# EasyEDA Pro project ProProject_nRF52840无线键盘_2024-02-15.epro, board PCB4
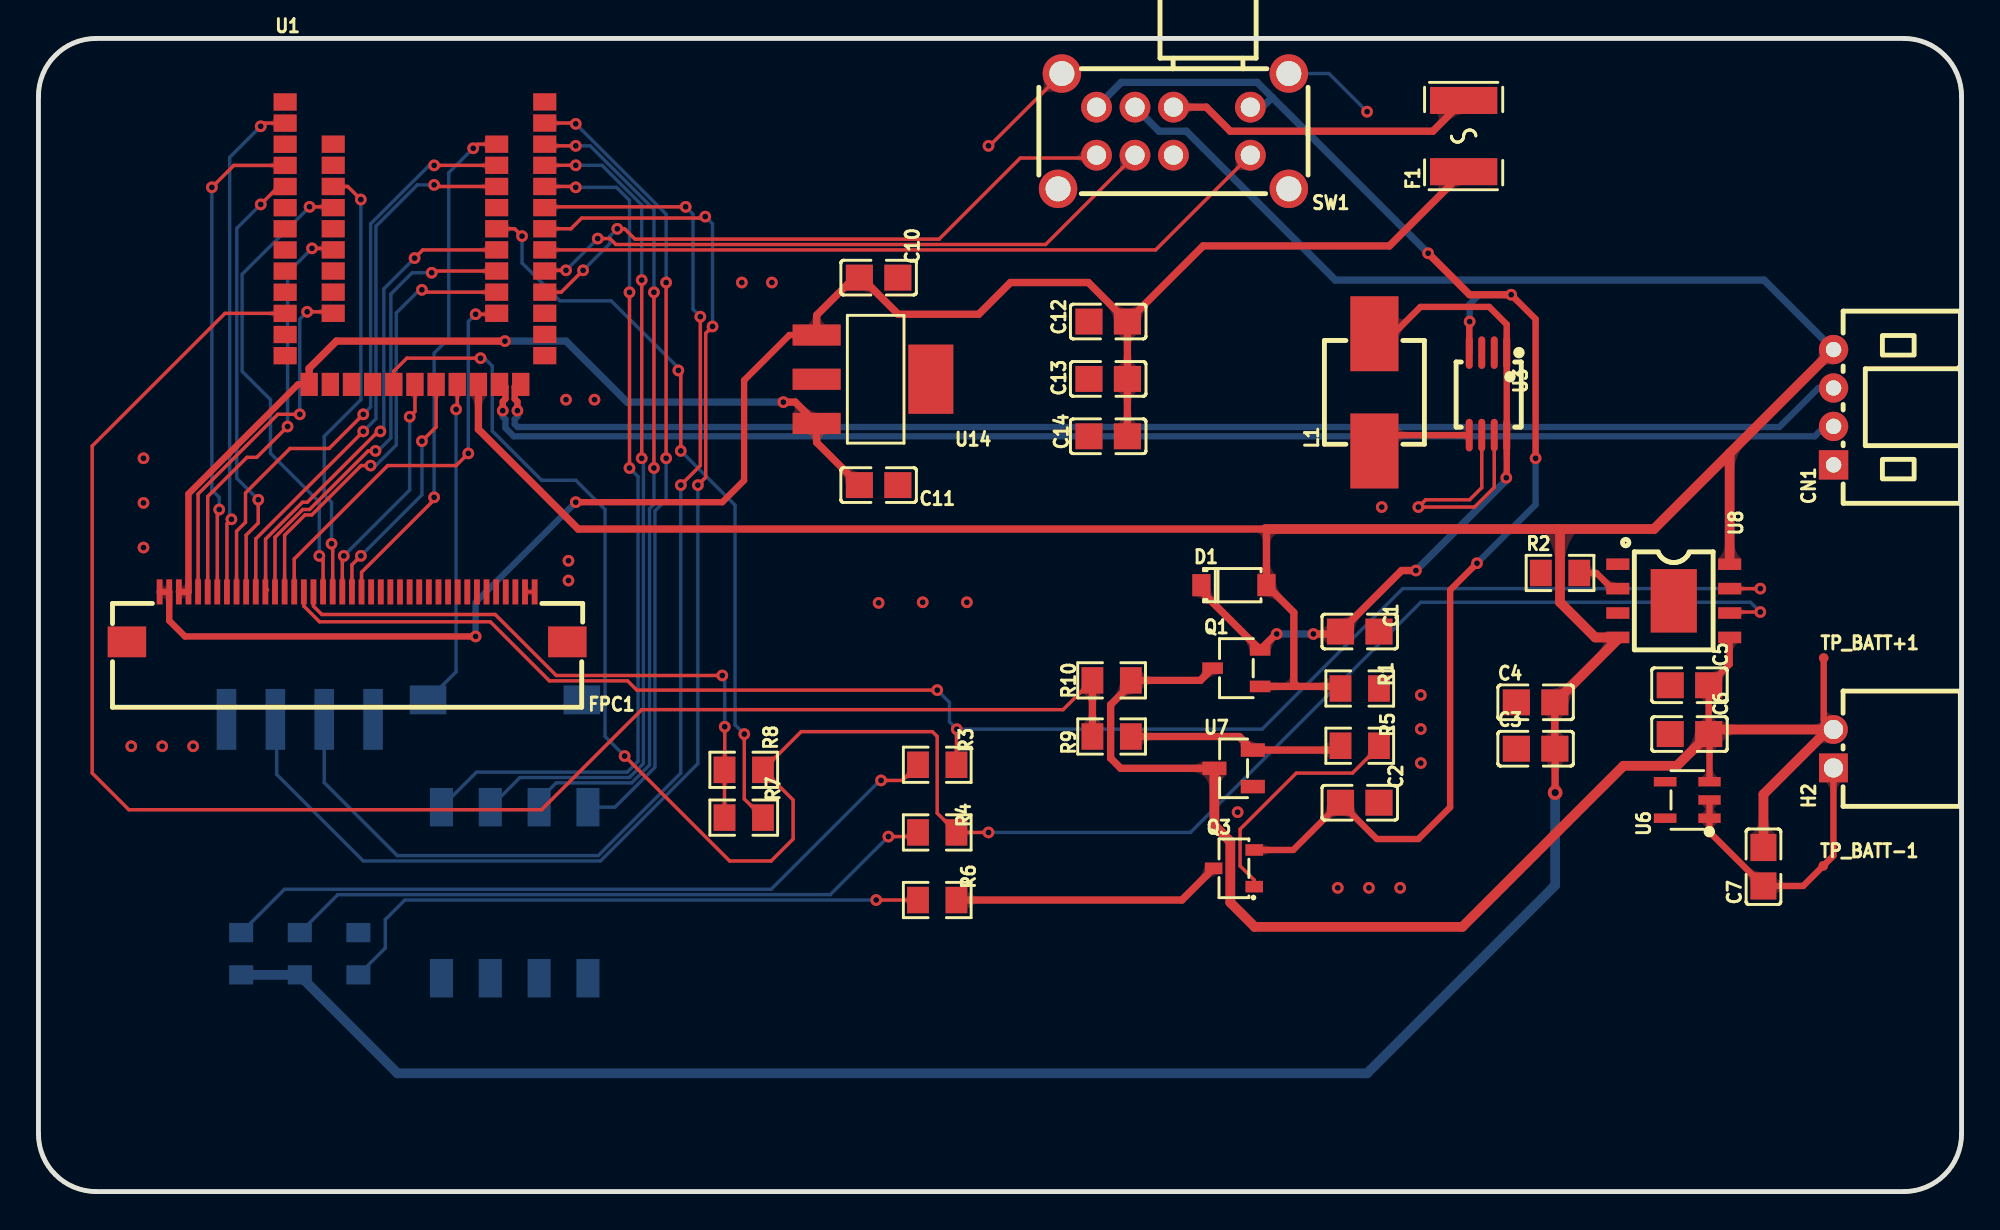
[diagram p18: board, top side]
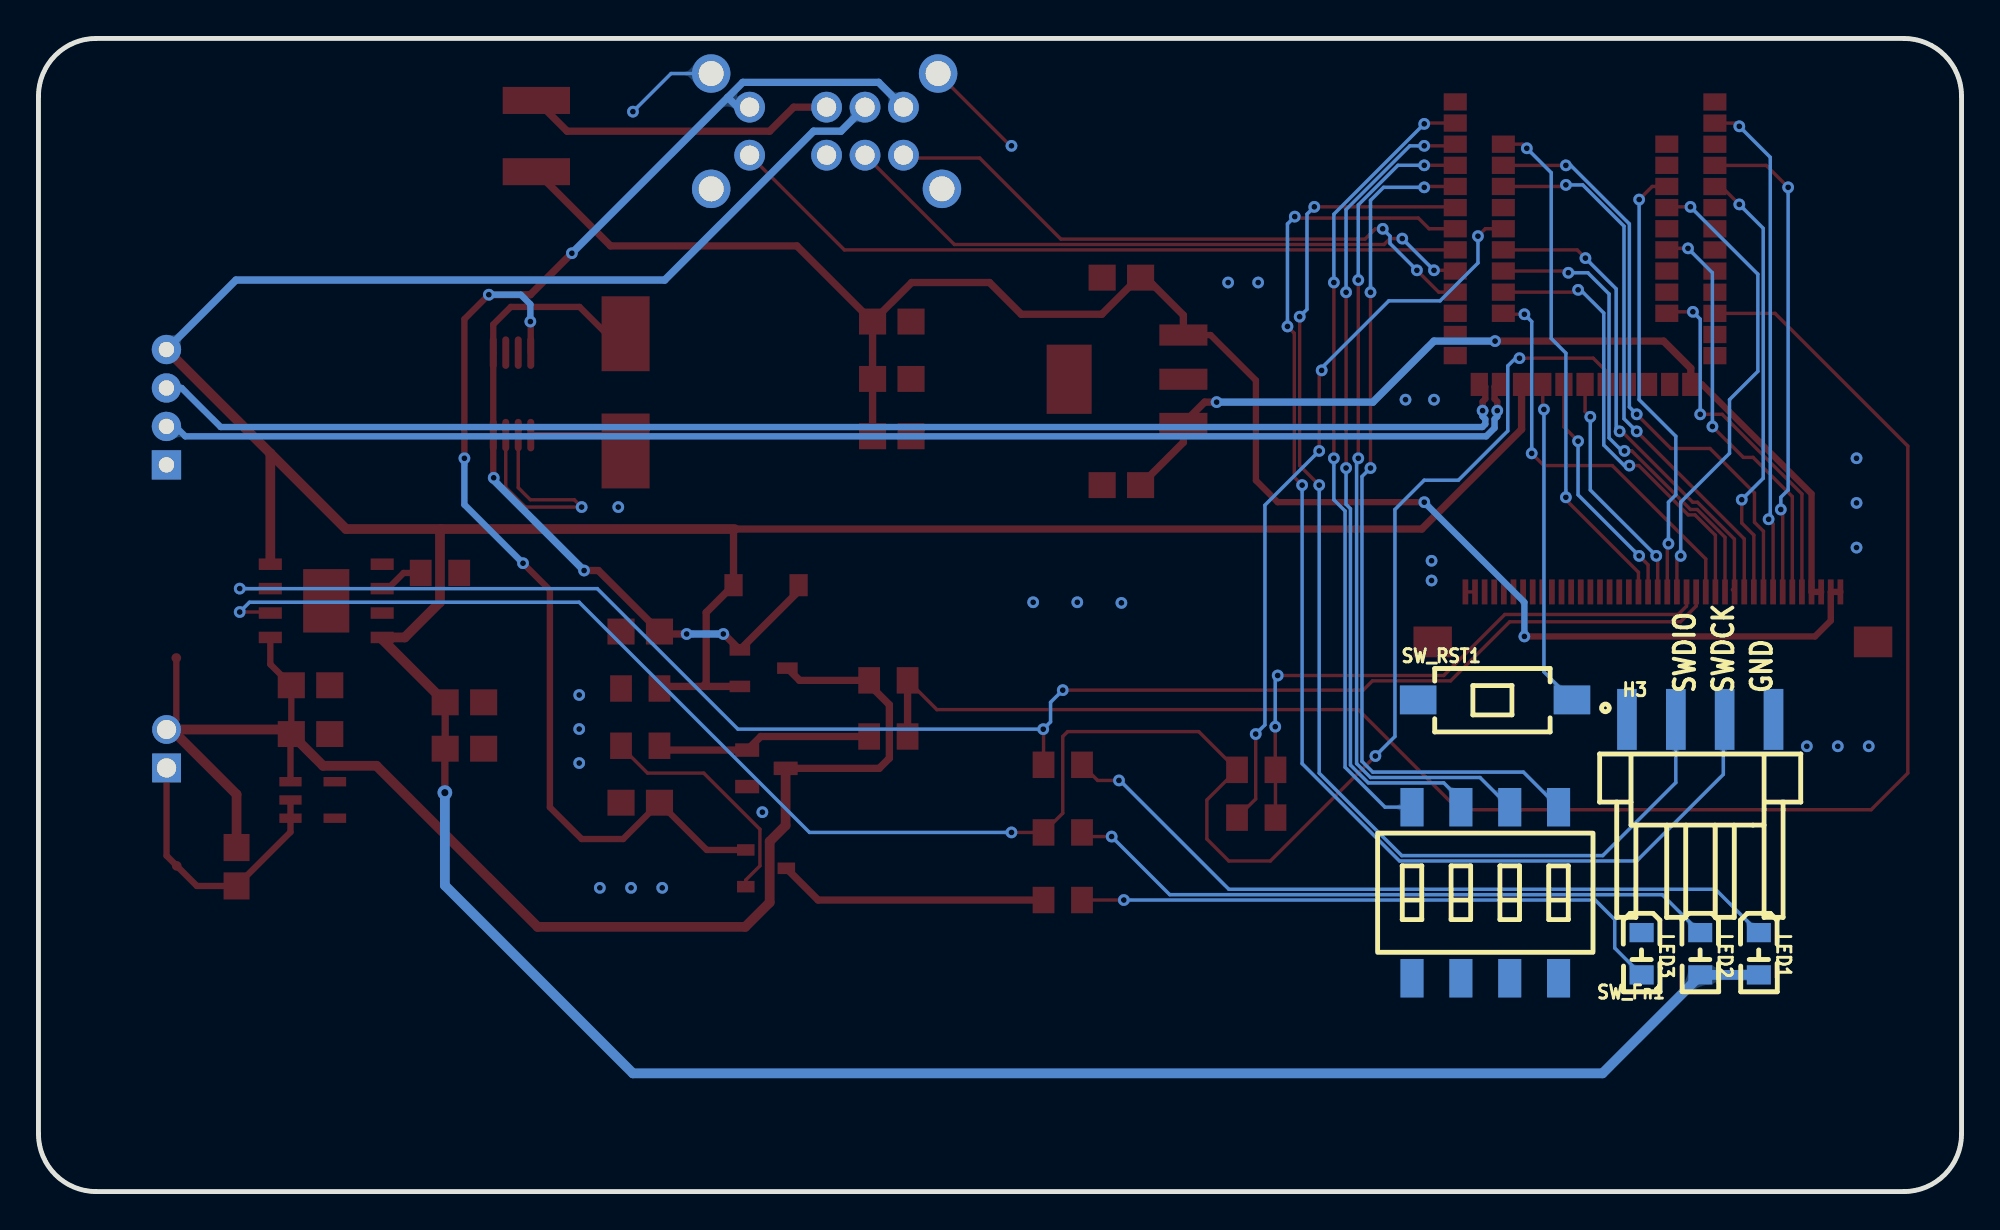
[diagram p19: board, bottom side, seen from below]

Outline 100 x 60 mm; copper layers: Top Layer, Bottom Layer. Coordinates in mm from the lower left corner of the outline.
Outline path: 0,57 0,3 arc(0.88,0.88) 3,0 97,0 arc(99.12,0.88) 100,3 100,57 arc(99.12,59.12) 97,60 3,60 arc(0.88,59.12) 0,57
Stack: Top Layer 0.035mm / Dielectric1 1.51mm FR4 er 4.5 / Bottom Layer 0.035mm

## Design rules (mm)
net D+: DP1
net D-: DP1
template: JLCPCB Capability(Two Layers Board)
spacing copperThickness1oz (default): track to track 0.102, other pairs 0.152 to 0.3
spacing copperThickness2oz: track to track 0.203, other pairs 0.152 to 0.3
track width copperThickness1oz (default): min 0.127, default 0.254, max 2.54
track width copperThickness2oz: min 0.203, default 0.254, max 2.54
differential pair differentialPair (default): width min 0.127, default 0.254, max 2.54; gap min 0.152, default 0.152
via viaSize (default): diameter min 0.5, default 0.61, max 10; hole min 0.3, default 0.305, max 6.3

## Placement (name value [footprint] x y rotation side)
C1  10uF  [C0805]  68.71 29.14 180 top
C2  10uF  [C0805]  68.71 20.23 180 top
C3  10uF  [C0805]  77.85 23.04 0 top
C4  100nF  [C0805]  77.85 25.46 0 top
C5  10uF  [C0805]  85.85 26.34 180 top
C6  100nF  [C0805]  85.85 23.81 180 top
C7  100nF  [C0805]  89.7 16.9 90 top
C10  1uF  [C0805]  43.69 47.55 180 top
C11  1uF  [C0805]  43.69 36.76 180 top
C12  10uF  [C0805]  55.63 45.27 0 top
C13  100nF  [C0805]  55.63 42.28 0 top
C14  1uF  [C0805]  55.63 39.3 0 top
CN1  HDGC2001WR-4P  [CONN-TH_4P-P2.00_HDGC_HDGC2001WR-4P]  93.34 40.81 90 top
D1  B5817W  [SOD-123_L2.8-W1.8-LS3.7-RD]  62.16 31.55 0 top
F1  BSMD1812-300-16V  [F1812]  74.11 54.92 90 top
FPC1  AFC01-S40FCA-00  [FPC-SMD_P0.50-40P_FGS-XJ-H2.0]  16.05 29.9 180 top
H2  HDGC2001WR-2P  [CONN-TH_2P-P2.00_HDGC2001WR-2P]  93.34 23.04 90 top
H3  1125-1104G0Z087CR01  [CONN-SMD_1125-1104G0Z087CR01]  13.59 24.57 180 bottom
L1  4.7uH  [ind-smd_l5.4-w5.2_fxl0530]  69.47 41.58 90 top
LED1  NCD0805R1  [LED0805-RD_RED]  10.54 12.37 270 bottom
LED2  NCD0805R1  [LED0805-RD_RED]  13.59 12.37 270 bottom
LED3  NCD0805R1  [LED0805-RD_RED]  16.64 12.37 270 bottom
Q1  CJ3401  [SOT-23-3_L2.9-W1.6-P1.90-LS2.8-BR]  62.29 27.23 0 top
Q3  AO3401  [SOT-23-3_L2.9-W1.4-P1.90-LS2.6-BR]  62.16 16.82 0 top
R1  10kΩ  [R0805]  68.71 26.17 180 top
R2  1.5kΩ  [R0805]  79.12 32.19 0 top
R3  2kΩ  [R0805]  46.74 22.21 180 top
R4  2kΩ  [R0805]  46.74 18.69 180 top
R5  10kΩ  [R0805]  68.71 23.2 0 top
R6  5.1kΩ  [R0805]  46.74 15.17 0 top
R7  0Ω  [R0805]  36.67 19.46 180 top
R8  0Ω  [R0805]  36.67 21.94 180 top
R9  0Ω  [R0805]  55.8 23.68 0 top
R10  0Ω  [R0805]  55.8 26.6 0 top
SW1  SK-23D29-G080  [SW-TH_G-SWITCH_SK-23D29-G080]  59.02 55.17 180 top
SW_Fn1  DSIC04LS-P  [SW-SMD_8P-L11.1-W6.2-P2.54-LS9.8]  24.77 15.55 0 bottom
SW_RST1  TS-1101-C-W  [SW-SMD_L6.0-W3.3-LS8.0]  24.26 25.58 180 bottom
TP_BATT+1  -  [Test-Point-0.5mm]  92.83 27.76 0 top
TP_BATT-1  -  [Test-Point-0.5mm]  92.81 16.95 0 top
U1  -  [微雪 nrf52840]  12.83 56.7 0 top
U3  MCP1642B-50I/MS  [MSOP-8_L3.0-W3.0-P0.65-LS5.0-BL]  75.38 41.51 180 top
U6  IP3012A  [SOT-23-5_L3.0-W1.7-P0.95-LS2.8-BL]  85.74 20.38 90 top
U7  TPS3839G33DBZR  [SOT-23-3_L2.9-W1.3-P1.90-LS2.4-BR]  62.15 22.02 0 top
U8  TP4056  [ESOP-8_L4.9-W3.9-P1.27-LS6.0-BL-EP]  85.03 30.74 270 top
U14  MCP1825S-3002E/DB  [SOT-223-3_L6.4-W3.5-P2.30-LS7.0-BR]  43.43 42.27 180 top

## Footprints (pads in the part's own frame, mm; a bottom-side part is the same pattern mirrored in y, then rotated)
C0805
  rect 1.41x1.35 smd: 1(-1,0) 2(1,0)
CONN-SMD_1125-1104G0Z087CR01
  rect 1.02x3.17 smd: 1(-3.81,0) 2(-1.27,0) 3(1.27,0) 4(3.81,0)
CONN-TH_2P-P2.00_HDGC2001WR-2P
  rect 1.5x1.5 hole 1: 1(-1,0)
  round 1.5 hole 1: 2(1,0)
CONN-TH_4P-P2.00_HDGC_HDGC2001WR-4P
  rect 1.524x1.524 hole 0.8: 1(-3,0)
  round 1.524 hole 0.8: 2(-1,0) 3(1,0) 4(3,0)
ESOP-8_L4.9-W3.9-P1.27-LS6.0-BL-EP
  rect 0.6x1.2 smd: 1(-1.905,-2.909) 2(-0.635,-2.909) 3(0.635,-2.909) 4(1.905,-2.909) 5(1.905,2.909) 6(0.635,2.909) 7(-0.635,2.909) 8(-1.905,2.909)
  rect 3.3x2.4 smd: 9(0,0)
F1812
  rect 1.407x3.499 smd: 1(-1.853,0) 2(1.853,0)
FPC-SMD_P0.50-40P_FGS-XJ-H2.0
  rect 0.3x1.3 smd: 1(-9.75,-1.3) 2(-9.25,-1.3) 3(-8.75,-1.3) 4(-8.25,-1.3) 5(-7.75,-1.3) 6(-7.25,-1.3) 7(-6.75,-1.3) 8(-6.25,-1.3) 9(-5.75,-1.3) 10(-5.25,-1.3) 11(-4.75,-1.3) 12(-4.25,-1.3) 13(-3.75,-1.3) 14(-3.25,-1.3) 15(-2.75,-1.3) 16(-2.25,-1.3) 17(-1.75,-1.3) 18(-1.25,-1.3) 19(-0.75,-1.3) 20(-0.25,-1.3) 21(0.25,-1.3) 22(0.75,-1.3) 23(1.25,-1.3) 24(1.75,-1.3) 25(2.25,-1.3) 26(2.75,-1.3) 27(3.25,-1.3) 28(3.75,-1.3) 29(4.25,-1.3) 30(4.75,-1.3) 31(5.25,-1.3) 32(5.75,-1.3) 33(6.25,-1.3) 34(6.75,-1.3) 35(7.25,-1.3) 36(7.75,-1.3) 37(8.25,-1.3) 38(8.75,-1.3) 39(9.25,-1.3) 40(9.75,-1.3)
  rect 2x1.6 smd: 41(11.45,1.3) 42(-11.45,1.3)
ind-smd_l5.4-w5.2_fxl0530
  rect 3.9x2.5 smd: 1(-3.05,0) 2(3.05,0)
LED0805-RD_RED
  rect 1x1.25 smd: 1(-1.1,0) 2(1.1,0)
MSOP-8_L3.0-W3.0-P0.65-LS5.0-BL
  oval 0.364x1.692 smd: 1(-0.975,-2.146) 2(-0.325,-2.146) 3(0.325,-2.146) 4(0.975,-2.146) 5(0.975,2.146) 6(0.325,2.146) 7(-0.325,2.146) 8(-0.975,2.146)
R0805
  rect 1.133x1.377 smd: 1(-1,0) 2(1,0)
SOD-123_L2.8-W1.8-LS3.7-RD
  rect 0.95x1.15 smd: 1(-1.692,0) 2(1.692,0)
SOT-23-3_L2.9-W1.3-P1.90-LS2.4-BR
  rect 1.25x0.7 smd: 1(1,-0.95) 2(1,0.95) 3(-1,0)
SOT-23-3_L2.9-W1.4-P1.90-LS2.6-BR
  rect 0.91x0.6 smd: 1(1.055,-0.955) 2(1.055,0.955) 3(-1.055,0)
SOT-23-3_L2.9-W1.6-P1.90-LS2.8-BR
  rect 1.07x0.6 smd: 1(1.235,-0.95) 2(1.235,0.95) 3(-1.235,0)
SOT-23-5_L3.0-W1.7-P0.95-LS2.8-BL
  rect 0.49x1.157 smd: 1(-0.95,-1.153) 2(0,-1.153) 3(0.95,-1.153)
  rect 0.49x1.175 smd: 4(0.95,1.153) 5(-0.95,1.153)
SOT-223-3_L6.4-W3.5-P2.30-LS7.0-BR
  rect 2.5x1.1 smd: 1(2.97,-2.3) 2(2.97,0) 3(2.97,2.3)
  rect 2.34x3.6 smd: 4(-2.97,0)
SW-SMD_8P-L11.1-W6.2-P2.54-LS9.8
  rect 1.2x2 smd: 1(-3.81,-4.45) 2(-1.27,-4.45) 3(1.27,-4.45) 4(3.81,-4.45) 5(3.81,4.45) 6(1.27,4.45) 7(-1.27,4.45) 8(-3.81,4.45)
SW-SMD_L6.0-W3.3-LS8.0
  rect 1.9x1.5 smd: 1(-4,0) 2(4,0)
SW-TH_G-SWITCH_SK-23D29-G080
  round 1.6 hole 1: 1(-4,1.25) 2(0,1.25) 3(2,1.25) 4(4,1.25) 5(4,-1.25) 6(2,-1.25) 7(0,-1.25) 8(-4,-1.25)
  round 2 hole 1.3: 9(-6,3) 10(6,3) 11(-6,-3) 12(5.8,-3)
Test-Point-0.5mm
  round 0.5 smd: 1(0,0)
微雪 nrf52840
  rect 1.2x0.9 smd: 1(13.5,0) 2(13.5,-1.1) 3(13.5,-2.2) 4(13.5,-3.3) 5(13.5,-4.4) 6(13.5,-5.5) 7(13.5,-6.6) 8(13.5,-7.7) 9(13.5,-8.8) 10(13.5,-9.9) 11(13.5,-11) 12(13.5,-12.1) 13(13.5,-13.2) 25(0,-13.204) 26(0,-12.104) 27(0,-11.004) 28(0,-9.904) 29(0,-8.804) 30(0,-7.704) 31(0,-6.604) 32(0,-5.504) 33(0,-4.404) 34(0,-3.304) 35(0,-2.204) 36(0,-1.104) 37(0,-0.004) 38(11,-2.2) 39(11,-3.3) 40(11,-4.4) 41(11,-5.5) 42(11,-6.6) 43(11,-7.7) 44(11,-8.8) 45(11,-9.9) 46(11,-11) 47(2.5,-11) 48(2.5,-9.9) 49(2.5,-8.8) 50(2.5,-7.7) 51(2.5,-6.6) 52(2.5,-5.5) 53(2.5,-4.4) 54(2.5,-3.3) 55(2.5,-2.2)
  rect 0.9x1.2 smd: 14(12.25,-14.7) 15(11.15,-14.7) 16(10.05,-14.7) 17(8.95,-14.7) 18(7.85,-14.7) 19(6.75,-14.7) 20(5.65,-14.7) 21(4.55,-14.7) 22(3.45,-14.7) 23(2.35,-14.7) 24(1.25,-14.7)

## Nets
As in the schematic.

Pads without a net: FPC1 3 4 5 6 7 8 9 10 11 12 13 14 15 16 17 18; H3 1; U1 11 12 21 22 23 25 26 28 29 30 31 32 35 41 48 49 51 54 55; U3 2 3; U6 5

## Via types
v1: diameter 0.61, hole 0.305, Top Layer to Bottom Layer, 112 vias
v2: diameter 0.762, hole 0.381, Top Layer to Bottom Layer, 1 via

## Routing (per net, layer and track width the routed paths; a pad name or vN(x,y) marks a point on that pad's centre or on a via; arc(x,y) is an arc through that point)
GND: length 24.3
  Top Layer w0.178: SW1.12 49.46,54.41 v1(49.4,54.41) ; FPC1.2 FPC1.1 ; U3.6 75.05,36.63 74.42,36 72.14,36 v1(71.75,35.62) 74.68,35.62 75.7,36.64 U3.7
  Bottom Layer w0.178: SW1.11 67.1,58.17 v1(69.09,56.19)
  vias: v1(4.83,23.17) v1(5.46,38.16) v1(5.46,35.83) v1(5.46,33.51) v1(6.44,23.17) v1(8.04,23.17) v1(27.43,41.2) v1(27.56,32.82) v1(27.56,31.79) v1(28.91,41.2) v1(36.58,47.3) v1(38.14,47.3) v1(43.69,30.63) v1(45.98,30.66) v1(48.28,30.66) v1(62.36,19.74) v1(67.56,15.8) v1(69.19,15.8) v1(69.85,35.62) v1(70.81,15.8) v1(71.88,25.84) v1(71.88,24.07) v1(71.88,22.3)
VBUS: length 235.6
  Top Layer w0.381: 65.45,26.28 67.69,26.28 67.71,26.3 ; 65.45,26.28 Q1.1 ; 65.45,26.28 65.28,26.46 65.28,30.13 D1.2 63.86,34.42 63.81,34.47 28.07,34.47 22.88,39.66 U1.16 ; v2(78.87,20.76) 78.87,23.03 C3.2 C4.2
  Top Layer w0.508: 63.81,34.47 79.07,34.47 ; 79.07,34.47 79.12,34.42 79.12,30.66 80.95,28.83 U8.4 82.13,28.73 C4.2 ; 79.07,34.47 84.01,34.47 87.94,38.41 ; 87.94,38.41 CN1.4 ; 87.94,38.41 U8.8
  Bottom Layer w0.381: CN1.4 89.73,47.43 67.44,47.43 59.69,55.17 58.27,55.17 SW1.6
  Bottom Layer w0.508: LED1.2 13.55,11.27 18.67,6.15 69.09,6.15 78.87,15.93 v2(78.87,20.76)
VCC3V3: length 48
  Top Layer w0.33: U1.24 13.49,42 7.8,36.3 FPC1.37 FPC1.38
  Top Layer w0.381: C11.2 40.46,38.98 U14.3 39.35,41.08 v1(38.74,41.08) ; U1.24 14.08,42.83 15.49,44.25 v1(24.26,44.25)
  Bottom Layer w0.381: v1(24.26,44.25) 27.43,44.25 30.61,41.08 v1(38.74,41.08)
VCC4V7: length 37.5
  Top Layer w0.33: v1(76.33,37.14) 76.35,37.16 U3.8 U3.1 76.35,45.12 75.44,46.03 71.86,46.03 69.47,43.64
  Top Layer w0.381: v1(66.29,29.01) 67.58,29.01 C1.2 70.88,32.31 v1(71.63,32.31) ; D1.1 60.47,31.24 Q1.2 64.36,29.01 v1(64.39,29.01)
  Bottom Layer w0.381: v1(64.39,29.01) v1(66.29,29.01) ; v1(71.63,32.31) 76.33,37.01 v1(76.33,37.14)
BATT+: length 77.5
  Top Layer w0.33: U6.3 86.9,23.76 C6.1 C5.1 87.94,27.44 U8.5 ; TP_BATT+1.1 92.83,24.55 H2.2
  Top Layer w0.381: Q1.3 60.42,26.6 R10.2 56.8,26.38 55.75,25.33 55.75,22.55 56.28,22.02 U7.3
  Top Layer w0.508: H2.2 93.07,24.04 ; 93.07,24.04 87.09,24.04 C6.1 85.2,22.15 82.42,22.15 74.04,13.77 63.25,13.77 61.98,15.04 61.98,18.22 61.15,19.05 U7.3 ; 93.07,24.04 89.7,20.67 C7.2
BATT-: length 14.5
  Top Layer w0.33: U6.2 U6.1 86.9,18.71 C7.1 91.77,15.9 TP_BATT-1.1 93.34,17.47 H2.1
BATT_LOW: length 11.3
  Top Layer w0.381: R5.1 67.48,22.97 U7.2 62.44,23.68 R9.2
BATT_SENS: length 88.4
  Top Layer w0.178: R10.1 53.28,25.08 31.37,25.08 26.16,19.87 4.7,19.87 2.79,21.77 2.79,38.79 9.7,45.69 U1.27
  Top Layer w0.381: R9.1 R10.1
BATTERY_LED: length 21.6
  Top Layer w0.178: v1(22.35,38.41) 21.72,37.78 18.16,37.78 13.3,32.91 FPC1.26 ; U1.46 23.78,45.65 v1(22.73,45.65)
  Bottom Layer w0.178: v1(22.73,45.65) 22.35,45.27 v1(22.35,38.41)
CAP_LOCK: length 23.3
  Top Layer w0.178: v1(19.94,46.92) 20.06,46.8 U1.45 ; FPC1.27 12.8,34.15 13.86,35.21 14.21,35.21 16.78,37.78 v1(17.27,37.78)
  Bottom Layer w0.178: v1(17.27,37.78) 17.54,37.78 18.61,38.84 18.61,45.71 19.81,46.92 v1(19.94,46.92)
CE#: length 25.5
  Top Layer w0.178: U1.34 10.16,53.39 v1(9.02,52.25) ; v1(9.4,35.49) 9.3,35.39 FPC1.34
  Bottom Layer w0.178: v1(9.4,35.49) 9.4,36.12 9.02,36.51 v1(9.02,52.25)
CHARGE_LED: length 86.2
  Top Layer w0.178: FPC1.25 13.8,30.46 14.61,29.65 23.5,29.65 26.57,26.57 30.63,26.57 31.12,26.09 v1(46.74,26.09) ; U8.7 v1(89.53,31.37) ; R3.1 47.74,24.04 v1(47.75,24.06)
  Bottom Layer w0.178: v1(46.74,26.09) 47.37,25.46 47.37,24.44 v1(47.75,24.06) 63.63,24.06 70.94,31.37 v1(89.53,31.37)
CP: length 21.6
  Top Layer w0.178: FPC1.35 8.8,36.16 10.84,38.2 11.35,38.2 v1(12.95,39.81) ; U1.50 15.25,49.08 v1(14.22,49.08)
  Bottom Layer w0.178: v1(12.95,39.81) 12.95,47.81 v1(14.22,49.08)
D+: length 71.9
  Top Layer w0.33: v1(24.9,40.63) 24.9,41.1 24.77,41.24 24.77,41.88 24.88,42 U1.14
  Bottom Layer w0.33: v1(24.9,40.63) 24.9,40.33 24.77,40.19 24.77,39.93 24.92,39.78 90.53,39.78 92.56,41.81 CN1.3
D-: length 72.1
  Top Layer w0.33: v1(24.14,40.63) 24.14,41.1 24.28,41.24 24.28,41.88 24.17,42 U1.15
  Bottom Layer w0.33: CN1.2 92.88,39.81 92.36,39.3 24.72,39.3 24.28,39.73 24.28,40.19 24.14,40.33 v1(24.14,40.63)
DIP1: length 45.3
  Top Layer w0.178: v1(27.94,52.25) 27.89,52.3 U1.5 ; v1(30.73,46.79) v1(30.73,37.65)
  Bottom Layer w0.178: SW_Fn1.1 22.78,21.82 30.62,21.82 31.18,22.39 31.18,37.2 v1(30.73,37.65) ; v1(27.94,52.25) 30.06,52.25 30.73,51.58 v1(30.73,46.79)
DIP2: length 43.9
  Top Layer w0.178: v1(31.37,47.43) v1(31.37,38.16) ; U1.4 v1(27.94,53.4)
  Bottom Layer w0.178: v1(31.37,38.16) 31.46,38.07 31.46,22.27 30.73,21.54 25.04,21.54 SW_Fn1.2 ; v1(31.37,47.43) 31.37,51.34 29.31,53.4 v1(27.94,53.4)
DIP3: length 43
  Top Layer w0.178: v1(27.94,54.41) 26.41,54.41 U1.3 ; v1(32,46.79) v1(32,37.65)
  Bottom Layer w0.178: SW_Fn1.3 26.03,20.38 26.92,21.27 30.85,21.27 31.78,22.19 31.78,35.53 32,35.76 v1(32,37.65) ; v1(27.94,54.41) 28.69,54.41 32,51.1 v1(32,46.79)
DIP4: length 41.6
  Top Layer w0.178: v1(32.64,47.3) v1(32.64,38.16) ; v1(27.94,55.56) 27.9,55.6 U1.2
  Bottom Layer w0.178: v1(32.64,47.3) 32.64,50.86 v1(27.94,55.56) ; v1(32.64,38.16) 32.64,36 32.06,35.41 32.06,22.08 29.98,20 SW_Fn1.4
KNOB_A: length 24.5
  Top Layer w0.178: v1(14.1,51.24) 15.29,51.24 U1.52 ; FPC1.23 14.8,32.88 v1(14.61,33.08)
  Bottom Layer w0.178: v1(14.61,33.08) 14.61,35.87 12.06,38.41 12.06,41.2 10.59,42.68 10.59,47.73 v1(14.1,51.24)
KNOB_B: length 23.1
  Top Layer w0.178: U1.53 16.08,52.3 v1(16.76,51.62) ; FPC1.22 15.3,33.65 v1(15.24,33.71)
  Bottom Layer w0.178: v1(16.76,51.62) 16.76,41.2 14.86,39.3 14.86,36.25 15.24,35.87 v1(15.24,33.71)
LED_BLUE: length 30.9
  Top Layer w0.178: R7.2 R8.2 35.69,21.96 v1(35.69,24.19) ; FPC1.24 14.3,30.46 14.73,30.03 23.75,30.03 26.92,26.85 v1(35.56,26.85)
  Bottom Layer w0.178: v1(35.56,26.85) 35.69,26.73 v1(35.69,24.19)
LED_CONTROL: length 28.8
  Top Layer w0.178: v1(20.57,52.38) 20.66,52.3 U1.40 ; v1(16.89,39.55) 11.3,33.96 FPC1.30
  Bottom Layer w0.178: v1(20.57,52.38) 19.7,52.38 17.55,50.23 17.55,40.21 v1(16.89,39.55)
LED_CUS: length 38.5
  Top Layer w0.178: v1(33.27,42.73) 33.4,42.6 v1(33.4,38.54) ; v1(36.7,23.81) 36.7,20.43 R7.1 ; v1(25.15,49.71) 24.76,50.1 U1.42
  Bottom Layer w0.178: v1(25.15,49.71) 25.15,48.32 27.11,46.35 29.78,46.35 33.27,42.86 v1(33.27,42.73) ; v1(36.7,23.81) 36.22,24.28 36.22,35.71 v1(33.4,38.54)
LEFT_CON: length 12.6
  Top Layer w0.178: v1(19.94,39.05) 20.68,39.78 U1.18 ; FPC1.20 16.3,32.61 v1(16.76,33.08)
  Bottom Layer w0.178: v1(16.76,33.08) 19.94,36.25 v1(19.94,39.05)
MODE_2.4: length 32.3
  Top Layer w0.178: v1(30.1,50.09) 30.48,50.09 31.02,49.56 46.83,49.56 51.05,53.78 54.87,53.78 SW1.4 ; v1(28.32,47.94) 27.18,46.8 U1.10
  Bottom Layer w0.178: v1(28.32,47.94) 29.72,49.33 29.72,49.71 v1(30.1,50.09)
MODE_BLE: length 38.7
  Top Layer w0.178: U1.8 58.09,49 SW1.1
MODE_WIRE: length 33.4
  Top Layer w0.178: SW1.3 52.37,49.28 30.03,49.28 29.72,49.59 v1(29.08,49.59) ; v1(27.43,47.94) 26.36,47.94 U1.9
  Bottom Layer w0.178: v1(29.08,49.59) v1(27.43,47.94)
MOS_CONTROL: length 31
  Top Layer w0.178: U1.39 23.83,53.4 v1(20.57,53.4) ; FPC1.32 10.3,34.36 10.77,34.83 10.77,36.35 13.08,38.66 15.11,38.66 v1(16.89,40.44)
  Bottom Layer w0.178: v1(20.57,53.4) 20.32,53.4 17.27,50.35 17.27,40.82 v1(16.89,40.44)
NUM_LOCK: length 24.5
  Top Layer w0.178: v1(20.45,47.81) 20.54,47.9 U1.44 ; v1(17.53,38.54) 17.14,38.54 14.1,35.49 13.74,35.49 12.3,34.04 FPC1.28
  Bottom Layer w0.178: v1(17.53,38.54) 17.65,38.54 18.33,39.21 18.33,46.7 19.43,47.81 v1(20.45,47.81)
PL#: length 26.4
  Top Layer w0.178: U1.36 11.72,55.59 v1(11.56,55.43) ; v1(10.03,34.98) 9.8,34.75 FPC1.33
  Bottom Layer w0.178: v1(10.03,34.98) 9.94,35.07 9.94,53.82 v1(11.56,55.43)
RGB_IN: length 23.1
  Top Layer w0.178: v1(11.43,36) 11.43,34.79 10.8,34.16 FPC1.31 ; U1.33 12.49,52.29 v1(11.56,51.36)
  Bottom Layer w0.178: v1(11.56,51.36) 10.31,50.12 10.31,37.11 v1(11.43,36)
RIGHT_CON: length 12.4
  Top Layer w0.178: v1(15.88,33.08) 15.8,33 FPC1.21 ; v1(19.3,40.31) 19.58,40.59 U1.19
  Bottom Layer w0.178: v1(19.3,40.31) 19.3,36.5 v1(15.88,33.08)
RST: length 17
  Top Layer w0.178: U1.17 21.78,40.76 v1(21.72,40.7)
  Bottom Layer w0.178: v1(21.72,40.7) 21.72,27.04 SW_RST1.2
SCAN_OUT_FIN: length 19
  Top Layer w0.178: FPC1.36 8.3,36.3 12.45,40.44 v1(13.59,40.44) ; v1(13.97,45.78) 15.25,45.78 U1.47
  Bottom Layer w0.178: v1(13.59,40.44) 13.59,45.39 v1(13.97,45.78)
SCR_LOCK: length 25.3
  Top Layer w0.178: FPC1.29 11.91,31.31 11.81,31.41 11.81,33.95 13.73,35.87 13.98,35.87 17.66,39.55 v1(17.78,39.55) ; v1(19.56,48.57) 19.99,49 U1.43
  Bottom Layer w0.178: v1(19.56,48.57) 17.96,46.97 17.96,39.73 v1(17.78,39.55)
STDBY#: length 110.2
  Top Layer w0.178: v1(22.99,43.36) 19.15,43.36 18.48,42.69 U1.20 ; v1(89.53,30.16) 88,30.16 U8.6 ; v1(49.4,18.69) R4.1 46.74,19.69 46.74,23.68 46.48,23.93 39.66,23.93 R8.1 39.24,20.38 39.24,18.34 38.1,17.2 35.94,17.2 v1(30.48,22.66)
  Bottom Layer w0.178: v1(30.48,22.66) 29.46,23.68 29.46,35.49 27.94,37.01 26.16,37.01 23.6,39.58 23.6,42.96 23.19,43.36 v1(22.99,43.36) ; v1(89.53,30.16) 89.03,30.66 71.88,30.66 59.91,18.69 v1(49.4,18.69)
SWDCLK: length 66.4
  Top Layer w0.178: v1(34.67,50.73) 34.59,50.65 28.25,50.65 27.69,50.1 U1.7 ; v1(35.05,45.01) 34.7,44.66 34.7,37.17 v1(34.29,36.76)
  Bottom Layer w0.178: v1(35.05,45.01) 35.05,50.35 v1(34.67,50.73) ; 12.59,24.57 12.39,24.36 12.39,21.71 16.89,17.2 29.22,17.2 34.29,22.27 v1(34.29,36.76)
SWDIO: length 62.8
  Top Layer w0.178: v1(33.4,36.76) 34.42,37.78 v1(34.42,45.52) ; v1(33.66,51.24) 26.37,51.24 U1.6
  Bottom Layer w0.178: v1(34.42,45.52) 34.04,45.9 34.04,50.86 v1(33.66,51.24) ; v1(33.4,36.76) 33.4,21.77 29.11,17.48 18.66,17.48 14.86,21.28 14.86,24.3 14.59,24.57
VCOM: length 93.6
  Top Layer w0.33: U14.1 39.05,44.57 36.69,42.21 36.69,37 35.56,35.87 v1(27.94,35.87) ; FPC1.40 FPC1.39 6.8,29.7 7.62,28.89 v1(22.73,28.89)
  Top Layer w0.381: C12.2 54.59,47.3 50.55,47.3 48.9,45.65 44.7,45.65 43.13,47.22 42.69,47.22 ; C12.2 60.56,49.2 70.25,49.2 F1.1 ; C12.2 C13.2 C14.2 ; 42.69,47.22 C10.2 ; 42.69,47.22 42.09,47.22 40.46,45.6 U14.1
  Bottom Layer w0.33: v1(22.73,28.89) 22.73,30.66 v1(27.94,35.87)
VOUT: length 74.6
  Top Layer w0.33: v1(74.8,32.69) 73.41,31.3 73.41,20 71.75,18.34 69.6,18.34 C2.2 65.25,17.78 63.22,17.78 ; v1(74.42,45.27) 74.4,45.25 U3.4 ; v1(76.58,46.67) 77.85,45.39 v1(77.85,38.16)
  Top Layer w0.381: v1(76.58,46.67) 74.42,46.67 v1(72.26,48.82)
  Bottom Layer w0.33: v1(74.8,32.69) 77.85,35.74 v1(77.85,38.16) ; v1(74.42,45.27) 74.42,46.17 74.92,46.67 v1(76.58,46.67)
  Bottom Layer w0.381: SW1.5 56.31,57.71 63.37,57.71 64.15,56.93 ; 64.15,56.93 v1(72.26,48.82) ; 64.15,56.93 63.65,56.42 SW1.8
WAKE_UP: length 26.8
  Top Layer w0.178: U1.38 22.82,54.5 v1(22.61,54.28) ; FPC1.19 16.8,32.22 20.57,36 v1(20.57,36.12)
  Bottom Layer w0.178: v1(20.57,36.12) 20.57,43.63 21.34,44.39 21.34,53.02 v1(22.61,54.28)
$1N2725: length 16.3
  Top Layer w0.381: SW1.7 60.73,56.42 61.98,55.17 72.51,55.17 F1.2
$2N1962: length 5
  Top Layer w0.33: U3.5 69.64,39.36 69.47,39.53
$2N1974: length 2.3
  Top Layer w0.33: R2.2 81.01,32.19 81.83,31.37 U8.2
$2N1979: length 38.8
  Top Layer w0.178: v1(43.81,21.39) 44.92,21.39 R3.2
  Bottom Layer w0.178: LED1.1 12.79,15.73 38.1,15.73 43.76,21.39 v1(43.81,21.39)
$2N1981: length 34.3
  Top Layer w0.178: v1(44.2,18.47) 45.52,18.47 R4.2
  Bottom Layer w0.178: LED2.1 15.56,15.45 41.17,15.45 v1(44.2,18.47)
$2N2010: length 31.6
  Top Layer w0.178: v1(43.56,15.17) R6.1
  Bottom Layer w0.178: v1(43.56,15.17) 19.05,15.17 18.03,14.15 18.03,12.67 LED3.2
$2N2012: length 14.1
  Top Layer w0.381: Q3.3 59.46,15.17 R6.2
$2N2217: length 12.3
  Top Layer w0.178: Q3.1 63.22,16.21 62.48,16.95 62.48,18.85 65.41,21.77 68.33,21.77 69.71,23.15 R5.2

## Copper pours and planes (outline as drawn; the poured copper is in the pictures)
GND on Top Layer: -1.02,57.21 116.71,57.21 116.71,-42.36 -1.02,-42.36
GND on Bottom Layer: -5.59,57.21 101.35,57.21 101.35,-59.13 -5.59,-59.13

Small or netless copper shapes (teardrops, artwork), in the pictures only: 253 on Top Layer, 112 on Bottom Layer

## Text on the board
Bottom Silkscreen Layer: GND | SWDCK | SWDIO
